# EAGLE design m1284p-40p-breakout board (EAGLE 9.6.2)
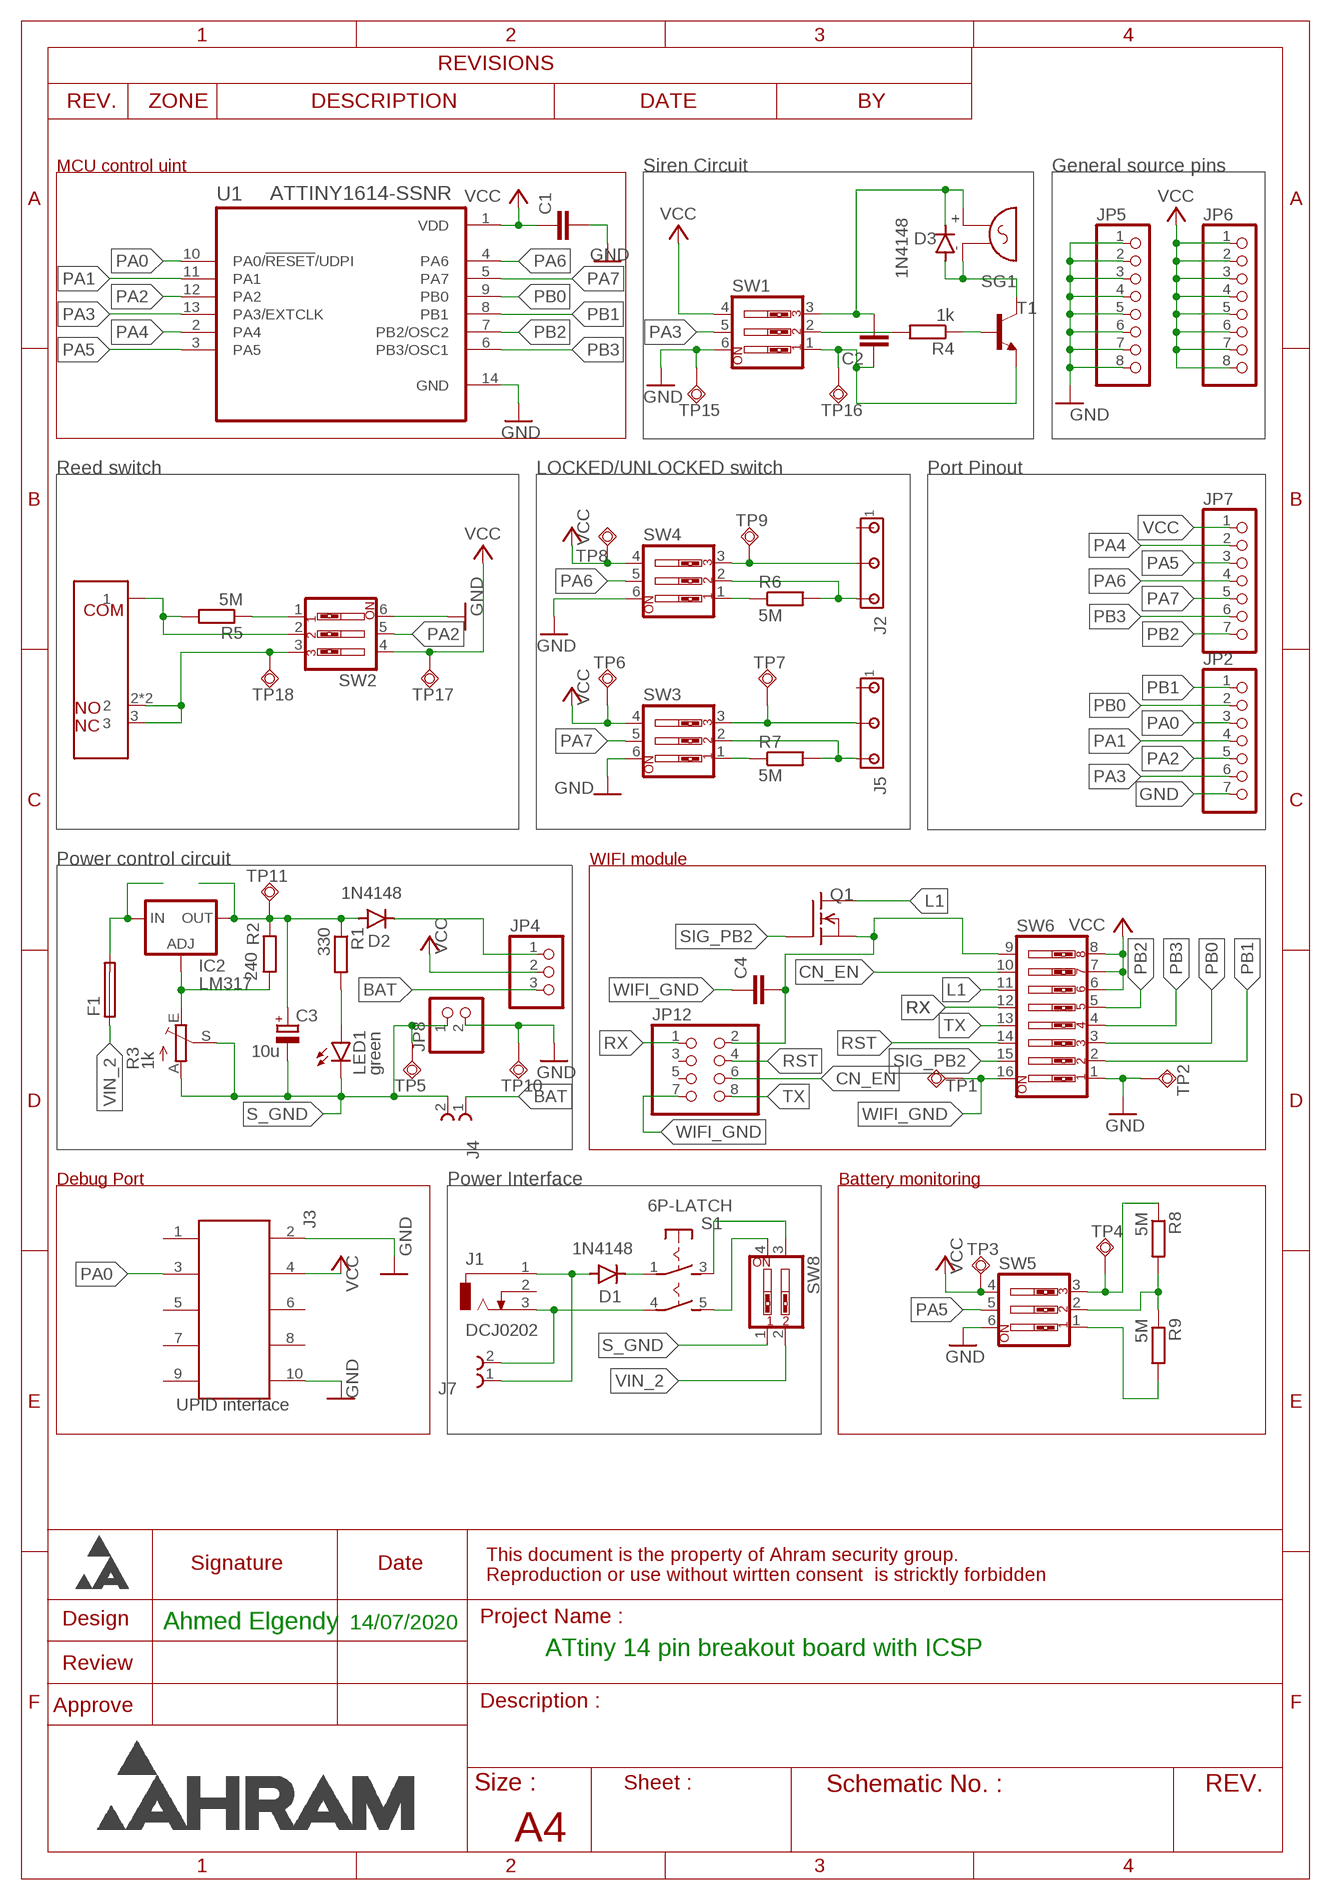
[diagram p0: schematic, sheet 1]

## Parts
C1  C-EU025-030X050  [C025-030X050]
C2  C-EU025-030X050  [C025-030X050]
C3  10u  CPOL-EUE2-4  [E2-4]
C4  C-EU025-030X050  [C025-030X050]
D1  1N4148  1N4148DO35-7  [DO35-7]
D2  1N4148  1N4148DO35-7  [DO35-7]
D3  1N4148  1N4148DO35-7  [DO35-7]
F1  SH22,5A  [SH22,5A]
IC2  LM317  LM317TS  [317TS]
J1  DCJ0202  [DCJ0202]
J2  MTA05-156_MYVSPACE1  [10X05MTA_MYV]
J3  UPID interface  612010235121  [612010235121]
J4  691101710002  [691101710002]
J5  MTA05-156_MYVSPACE1  [10X05MTA_MYV]
J7  691101710002  [691101710002]
JP2  PINHD-1X7  [1X07]
JP4  PINHD-1X3  [1X03]
JP5  PINHD-1X8  [1X08]
JP6  PINHD-1X8  [1X08]
JP7  PINHD-1X7  [1X07]
JP8  PINHD-1X2  [1X02]
JP12  PINHD-2X4  [2X04]
LED1  green  LED3MM  [LED3MM]
Q1  BSS295  [TO92]
R1  330  R-EU_0204/7  [0204/7]
R2  240  R-EU_0204/7  [0204/7]
R3  1k  TRIM_EU-RJ9W  [RJ9W]
R4  1k  R-EU_0204/7  [0204/7]
R5  5M  R-EU_0204/7  [0204/7]
R6  5M  R-EU_0204/7  [0204/7]
R7  5M  R-EU_0204/7  [0204/7]
R8  5M  R-EU_0204/7  [0204/7]
R9  5M  R-EU_0204/7  [0204/7]
S1  6P-LATCH  [TACT-6P-LATCH]
S2  REED_1513  [REED_MYV]
SG1  F/QMX  [F/QMX]
SW1  SW_DIP-3  [EDG-03]
SW2  SW_DIP-3  [EDG-03]
SW3  SW_DIP-3  [EDG-03]
SW4  SW_DIP-3  [EDG-03]
SW5  SW_DIP-3  [EDG-03]
SW6  SW_DIP-8  [EDG-08]
SW8  SW_DIP-2  [EDG-02]
T1  2N2222  [TO18]
TP1  TPSQPAD1-13  [P1-13]
TP2  TPSQPAD1-13  [P1-13]
TP3  TPSQPAD1-13  [P1-13]
TP4  TPSQPAD1-13  [P1-13]
TP5  TPSQPAD1-13  [P1-13]
TP6  TPSQPAD1-13  [P1-13]
TP7  TPSQPAD1-13  [P1-13]
TP8  TPSQPAD1-13  [P1-13]
TP9  TPSQPAD1-13  [P1-13]
TP10  TPSQPAD1-13  [P1-13]
TP11  TPSQPAD1-13  [P1-13]
TP15  TPSQPAD1-13  [P1-13]
TP16  TPSQPAD1-13  [P1-13]
TP17  TPSQPAD1-13  [P1-13]
TP18  TPSQPAD1-13  [P1-13]
U1  ATTINY1614-SSNR  [SOIC127P600X175-14N]

## Nets
BAT: J4.1 JP4.3
CN_EN: JP12.6 SW6.10
GND: C1.2 J3.2 J3.10 JP2.7 JP5.1 JP5.2 JP5.3 JP5.4 JP5.5 JP5.6 JP5.7 JP5.8 JP8.2 SW1.6 SW2.6 SW3.6 SW4.6 SW5.6 SW6.1 TP2.TP TP10.TP TP15.TP U1.14(GND)
L1: Q1.3(D) SW6.11
N$1: D1.C S1.1
N$2: C3.+ D2.A IC2.2(OUT) R1.1 R2.2 TP11.TP
N$3: D1.A J1.1 J7.1
N$4: LED1.A R1.2
N$5: R4.1 T1.2(B)
N$6: IC2.1(ADJ) R2.1 R3.E
N$7: J1.3 J7.2 S1.4
N$8: F1.2 IC2.3(IN)
N$9: J2.5 R6.2 SW4.2
N$10: R4.2 SW1.2
N$11: R5.2 S2.1 SW2.2
N$14: R8.2 R9.1 SW5.2
N$16: S1.5 SW8.4
N$18: R9.2 SW5.1
N$19: R5.1 SW2.1
N$20: J2.3 SW4.3 TP9.TP
N$21: R6.1 SW4.1
N$22: D2.C JP4.1
N$23: C2.2 D3.C SG1.+ SW1.3
N$24: C2.1 SW1.1 T1.1(E) TP16.TP
N$25: S2.2 S2.3 S2.4 SW2.3 TP18.TP
N$26: R8.1 SW5.3 TP4.TP
N$27: R7.1 SW3.1
N$28: D3.A SG1.- T1.3(C)
N$29: J5.5 R7.2 SW3.2
N$30: J5.3 SW3.3 TP7.TP
N$32: C4.2 JP12.2 Q1.1(S) SW6.9
PA0: J3.3 JP2.3 U1.10(PA0/!RESET!/UDPI)
PA1: JP2.4 U1.11(PA1)
PA2: JP2.5 SW2.5 U1.12(PA2)
PA3: JP2.6 SW1.5 U1.13(PA3/EXTCLK)
PA4: JP7.2 U1.2(PA4)
PA5: JP7.3 SW5.5 U1.3(PA5)
PA6: JP7.4 SW4.5 U1.4(PA6)
PA7: JP7.5 SW3.5 U1.5(PA7)
PB0: JP2.2 SW6.3 U1.9(PB0)
PB1: JP2.1 SW6.2 U1.8(PB1)
PB2: JP7.7 SW6.5 U1.7(PB2/OSC2)
PB3: JP7.6 SW6.4 U1.6(PB3/OSC1)
RST: JP12.4 SW6.14
RX: JP12.1 SW6.12
S_GND: C3.- J4.2 JP8.1 LED1.K(C) R3.A R3.S SW8.1 TP5.TP
SIG_PB2: Q1.2(G) SW6.15
TX: JP12.8 SW6.13
VCC: C1.1 J3.4 JP4.2 JP6.1 JP6.2 JP6.3 JP6.4 JP6.5 JP6.6 JP6.7 JP6.8 JP7.1 SW1.4 SW2.4 SW3.4 SW4.4 SW5.4 SW6.6 SW6.7 SW6.8 TP3.TP TP6.TP TP8.TP TP17.TP U1.1(VDD)
VIN_1: S1.3 SW8.3
VIN_2: F1.1 SW8.2
WIFI_GND: C4.1 JP12.7 SW6.16 TP1.TP
Unconnected: J1.2 J2.1 J3.1 J3.5 J3.6 J3.7 J3.8 J3.9 J5.1 JP12.3 JP12.5

## Notes on the sheet
- MCU control uint | Siren Circuit | General source pins
- Reed switch | LOCKED/UNLOCKED switch | Port Pinout
- Power control circuit | WIFI module
- Debug Port | Power Interface | Battery monitoring
- Ahmed Elgendy | 14/07/2020
- ATtiny 14 pin breakout board with ICSP

## Library data of the parts
C1 C2 C4 = rcl:C-EU: CAPACITOR, European symbol; SPICEPREFIX: C
C3 = rcl:CPOL-EU: POLARIZED CAPACITOR, European symbol; SPICEPREFIX: C
D1-D3 = diode:1N4148: DIODE high speed (Philips)
F1 = fuse:SH22,5A: FUSE HOLDER grid 22,5mm, isolated cap OGN0031 8201, Schurter (Buerklin); MPN: 0031.7701.11; OC_FARNELL: unknown; OC_NEWARK: 04F1224
IC2 = v-reg:LM317TS: VOLTAGE REGULATOR
J1 = con-jack:DCJ0202: DC POWER JACK Source: DCJ0202.pdf; OC_FARNELL: unknown; OC_NEWARK: unknown
J2 J5 = con-amp_edit:MTA05-156_MYV: AMP connector
J3 = Wire-to-Board (rev17c):612010235121: WR-BHD 2.54mm Male Box Header High Temperature, 10 Pins=>Code : Con_WTB_BHD_2.54_Male_THT_RS_612010235121 <http://katalog.we-online.de/media/thumbs2/eican/thb_Con_WTB_BHD_2.54_Male_THT_RS_6120xx235121_pf2.jpg> Details see: http://katalog.we-online.de/en/em/612_0xx_235_121 Created 2014-06-05, Karrer Zheng 2014 (C) Würth Elektronik
J4 J7 = Wurth_Elektronik_Electromechanic_Terminal_Blocks_Connectors_rev16b:691101710002: WR-TBL Serie 101 - 5.0mm HOrizontal Entry Modular with Pressure Clamp - 2.5mm2 Wires , 2 pins=>Code : Con-TBL_Screw_PressureClamp_691101710002 <http://katalog.we-online.de/media/images/eican/Con-TBL_Screw_PressureClamp_6911017100xx_pf2.jpg> Details see: http://katalog.we-online.de/en/em/691_101_710_0xx Created 2014-06-16, Karrer Zheng 2014 (C) Würth Elektronik
JP2 JP7 = pinhead:PINHD-1X7: PIN HEADER
JP4 = pinhead:PINHD-1X3: PIN HEADER
JP5 JP6 = pinhead:PINHD-1X8: PIN HEADER
JP8 = pinhead:PINHD-1X2: PIN HEADER
JP12 = pinhead:PINHD-2X4: PIN HEADER
LED1 = led:LED: LED OSRAM: - CHIPLED LG R971, LG N971, LY N971, LG Q971, LY Q971, LO R971, LY R971 LH N974, LH R974 LS Q976, LO Q976, LY Q976 LO Q996 - Hyper CHIPLED LW Q18S LB Q993, LB Q99A, LB R99A - SideLED LS A670, LO A670, LY A670, LG A670, LP A670 LB A673, LV A673, LT A673, LW A673 LH A674 LY A675 LS A676, LA A676, LO A676, LY A676, LW A676 LS A679, LY A679, LG A679 - Hyper Micro SIDELED® LS Y876, LA Y876, LO Y876, LY Y876 LT Y87S - SmartLED LW L88C, LW L88S LB L89C, LB L89S, LG L890 LS L89K, LO L89K, LY L89K LS L896, LA L896, LO L896, LY L896 - TOPLED LS T670, LO T670, LY T670, LG T670, LP T670 LSG T670, LSP T670, LSY T670, LOP T670, LYG T670 LG T671, LOG T671, LSG T671 LB T673, LV T673, LT T673, LW T673 LH T674 LS T676, LA T676, LO T676, LY T676, LB T676, LH T676, LSB T676, LW T676 LB T67C, LV T67C, LT T67C, LS T67K, LO T67K, LY T67K, LW E67C LS E67B, LA E67B, LO E67B, LY E67B, LB E67C, LV E67C, LT E67C LW T67C LS T679, LY T679, LG T679 LS T770, LO T770, LY T770, LG T770, LP T770 LB T773, LV T773, LT T773, LW T773 LH T774 LS E675, LA E675, LY E675, LS T675 LS T776, LA T776, LO T776, LY T776, LB T776 LHGB T686 LT T68C, LB T68C - Hyper Mini TOPLED® LB M676 - Mini TOPLED Santana® LG M470 LS M47K, LO M47K, LY M47K Source: http://www.osram.convergy.de LUXEON: - LUMILED® LXK2-PW12-R00, LXK2-PW12-S00, LXK2-PW14-U00, LXK2-PW14-V00 LXK2-PM12-R00, LXK2-PM12-S00, LXK2-PM14-U00 LXK2-PE12-Q00, LXK2-PE12-R00, LXK2-PE12-S00, LXK2-PE14-T00, LXK2-PE14-U00 LXK2-PB12-K00, LXK2-PB12-L00, LXK2-PB12-M00, LXK2-PB14-N00, LXK2-PB14-P00, LXK2-PB14-Q00 LXK2-PR12-L00, LXK2-PR12-M00, LXK2-PR14-Q00, LXK2-PR14-R00 LXK2-PD12-Q00, LXK2-PD12-R00, LXK2-PD12-S00 LXK2-PH12-R00, LXK2-PH12-S00 LXK2-PL12-P00, LXK2-PL12-Q00, LXK2-PL12-R00 Source: www.luxeon.com KINGBRIGHT: KA-3528ASYC Source: www.kingbright.com
Q1 = transistor-fet_myv:BSS295: N-Channel Enhancement MOSFET not checked
R1 R2 R4-R9 = rcl:R-EU_: RESISTOR, European symbol; SPICEPREFIX: R
R3 = pot:TRIM_EU-: POTENTIOMETER
S1 = switches-misc v2.2:6P-LATCH
S2 = reed_MYV:REED_1513
SG1 = buzzer:F/QMX: BUZZER Source: Buerklin; OC_FARNELL: unknown; OC_NEWARK: unknown
SW1-SW5 = special:SW_DIP-3: DIP SWITCH
SW6 = special:SW_DIP-8: DIP SWITCH
SW8 = special:SW_DIP-2: DIP SWITCH
T1 = transistor:2N2222: NPN TRANSISTOR
TP1-TP11 TP15-TP18 = testpad:TPSQ: Test pad
U1 = ATTINY1614-SSNR:ATTINY1614-SSNR: 20MHz, SOIC, 85C, Green, 14 SOIC .150in T/R; ARROW_ELECTRONICS-PURCHASE-URL: https://snapeda.com/shop?store=Arrow+Electronics&id=4817174; AVAILABILITY: Unavailable; DESCRIPTION: IC MCU 8BIT 16KB FLASH 14SOIC; DIGIKEY-PURCHASE-URL: https://snapeda.com/shop?store=DigiKey&id=4817174; MF: Microchip Technology; MOUSER-PURCHASE-URL: https://snapeda.com/shop?store=Mouser&id=4817174; MP: ATTINY1614-SSNR; PACKAGE: None; PRICE: None

## Board
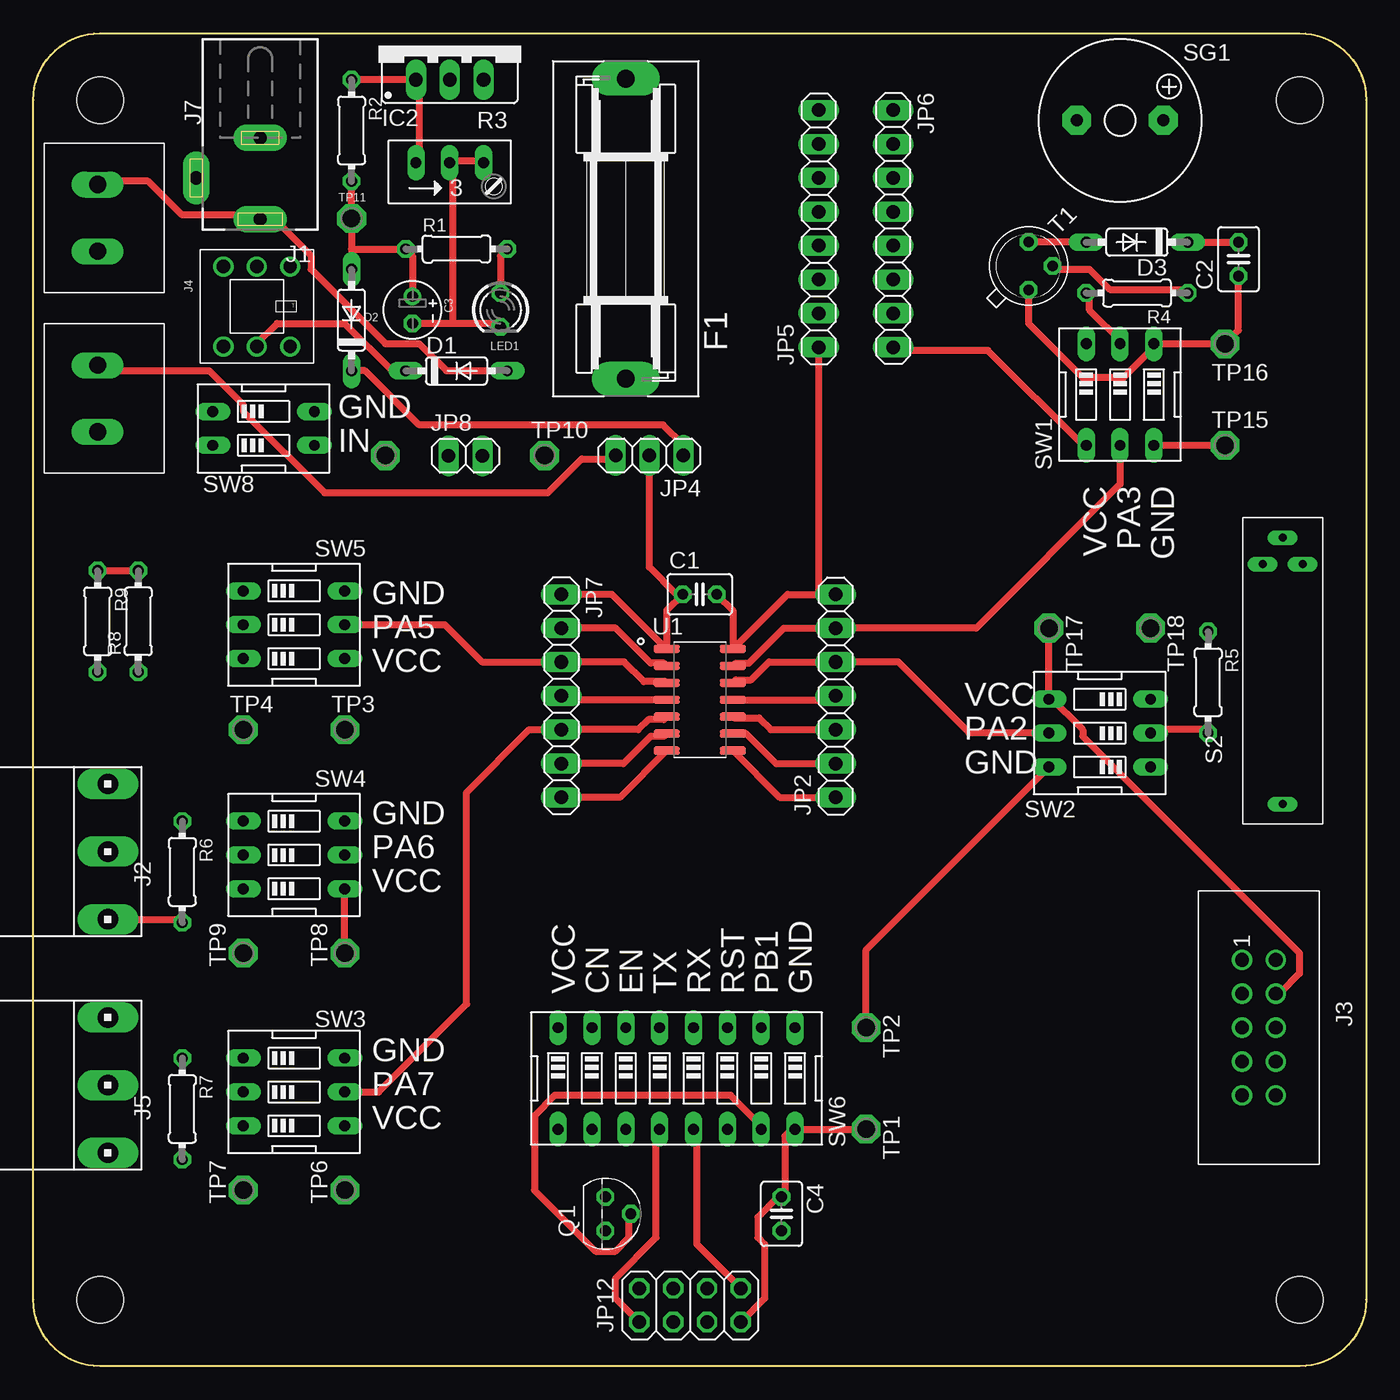
[diagram p1: board, top side]
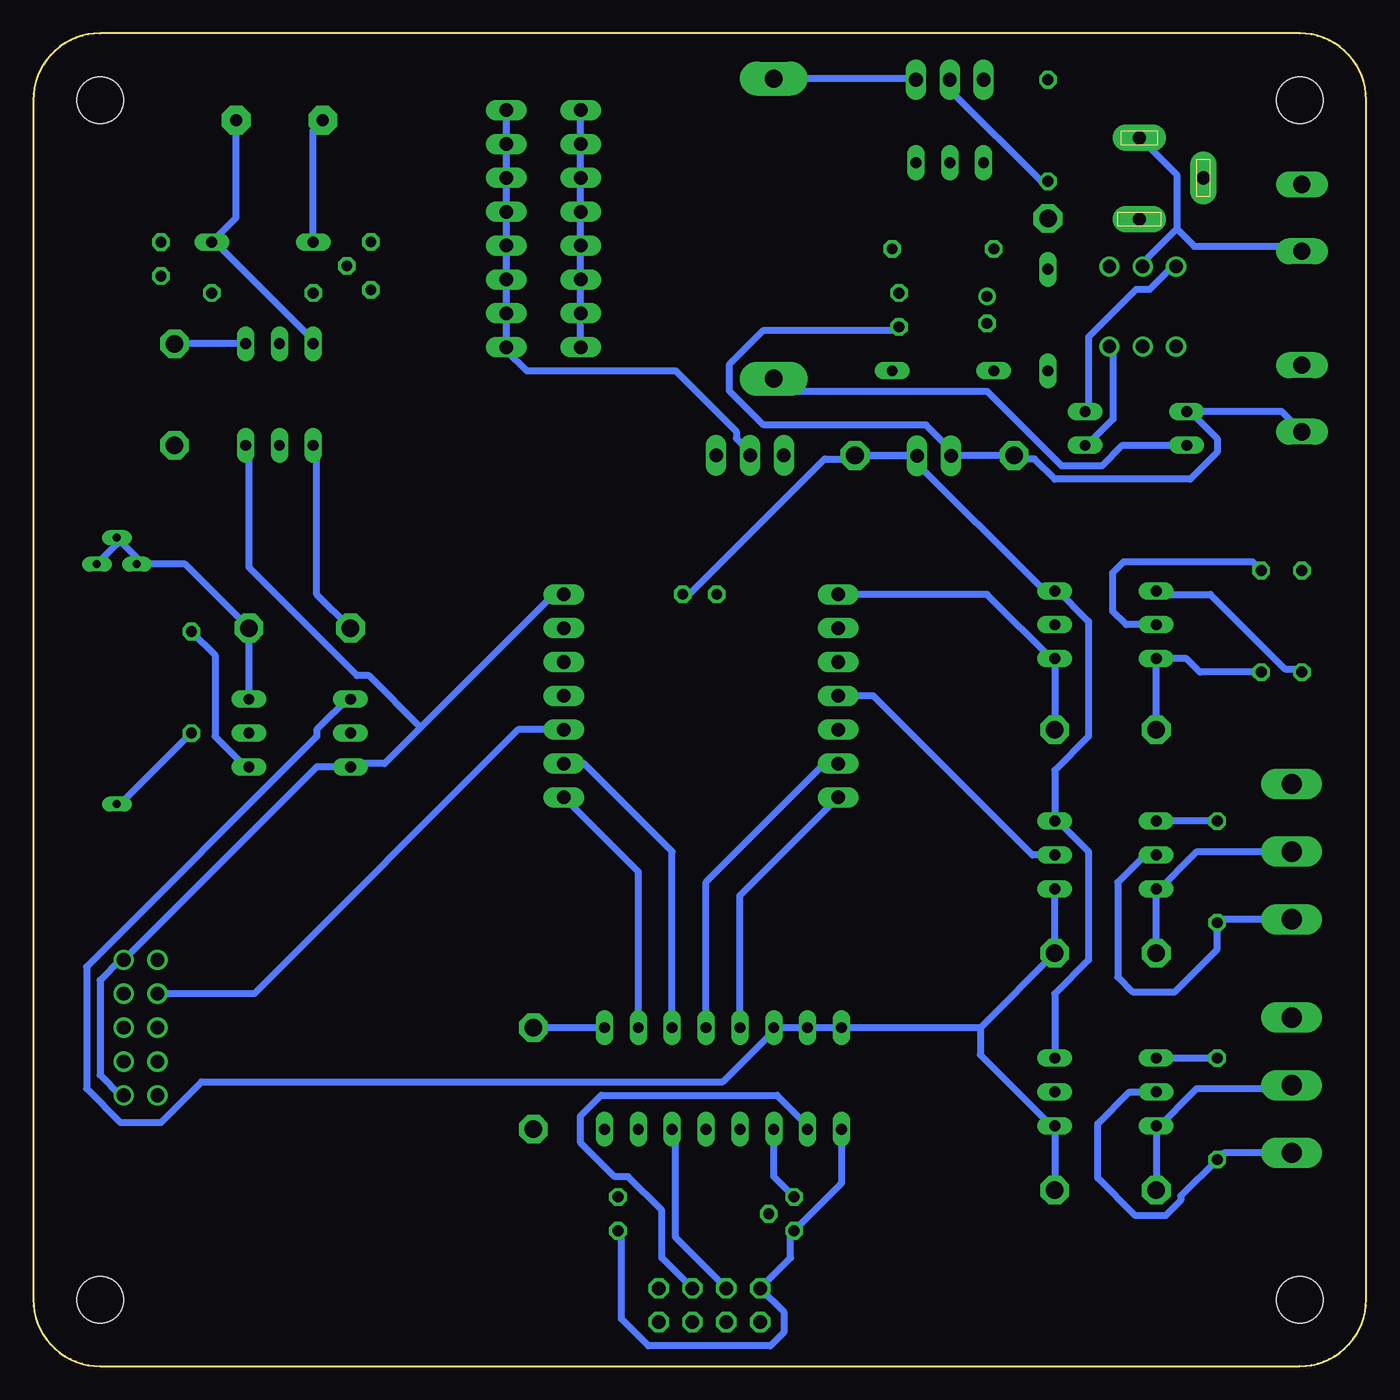
[diagram p2: board, bottom side, seen from below]

Size 100 x 100 mm. Coordinates in mm from the lower left corner, seen from the top.
Outline: 0,5 0,95 arc-90 5,100 95,100 arc-90 100,95 100,5 arc-90 95,0 5,0 arc-90 0,5
Copper layers (1*16): Top 0.035mm / dielectric 1.5mm / Bottom 0.035mm
Design rules "default *": minimum track width 20mil, minimum drill 0.35mm, track to track 20mil, track to pad 20mil, pad to pad 20mil, via to via 20mil, smd to smd 20mil, copper to edge 40mil, drill to drill 6mil, minimum pad ring 10mil, minimum via ring 8mil, stop-mask expansion 4mil, vias tented up to drill 0mil, thermal gap 10mil
Holes 3.5 mm at 5,95 95,95 95,5 5,5

### Footprints (pad centres in the part's own frame; a part is rotated, then mirrored left to right if it is on the bottom)
C025-030X050 = drill 0.813 octagon: 1 -1.27,0; 2 1.27,0
E2-4 = drill 0.813 pad 1.27: + -1.016,0 | drill 0.813 pad 1.27 octagon: - 1.016,0
DO35-7 = drill 0.813 long: A 3.81,0; C -3.81,0
SH22,5A = drill 1.321 pad 2.54 long: 1 -11.252,0; 2 11.252,0
317TS = drill 1.016 long: 1 -2.54,-2.54; 2 0,-2.54; 3 2.54,-2.54
DCJ0202 = drill 1 pad 2 long: 1 0,3.1; 2 4.8,0; 3 0,-3
10X05MTA_MYV = drill 1.524 long: 1 5.08,0; 3 0,0; 5 -5.08,0
612010235121 = drill 1.02: 1 -5.08,-1.27; 2 -5.08,1.27; 3 -2.54,-1.27; 4 -2.54,1.27; 5 0,-1.27; 6 0,1.27; 7 2.54,-1.27; 8 2.54,1.27; 9 5.08,-1.27; 10 5.08,1.27
691101710002 = drill 1.3 long: 1 -5,0; 2 0,0
1X07 = drill 1.016 long: 1 -7.62,0; 2 -5.08,0; 3 -2.54,0; 4 0,0; 5 2.54,0; 6 5.08,0; 7 7.62,0
1X03 = drill 1.016 long: 1 -2.54,0; 2 0,0; 3 2.54,0
1X08 = drill 1.016 long: 1 -8.89,0; 2 -6.35,0; 3 -3.81,0; 4 -1.27,0; 5 1.27,0; 6 3.81,0; 7 6.35,0; 8 8.89,0
1X02 = drill 1.016 long: 1 -1.27,0; 2 1.27,0
2X04 = drill 1.016 octagon: 1 -3.81,-1.27; 2 -3.81,1.27; 3 -1.27,-1.27; 4 -1.27,1.27; 5 1.27,-1.27; 6 1.27,1.27; 7 3.81,-1.27; 8 3.81,1.27
LED3MM = drill 0.813 octagon: A -1.27,0; K 1.27,0
TO92 = drill 0.813 octagon: 1 1.27,0; 2 0,1.905; 3 -1.27,0
0204/7 = drill 0.813 octagon: 1 -3.81,0; 2 3.81,0
RJ9W = drill 0.813 long: A 2.54,0.635; E -2.54,0.635; S 0,0.635
TACT-6P-LATCH = drill 1: 1 0,-3; 2 -2.5,-3; 3 2.5,-3; 4 0,3; 5 -2.5,3; 6 2.5,3
REED_MYV = drill 0.6 long: 1 0,0; 2 0,20; 3 -1.5,18; 4 1.5,18
F/QMX = drill 0.914 pad 2.159 octagon: + 3.251,0; - -3.251,0
EDG-03 = drill 0.813 long: 1 -2.54,-3.81; 2 0,-3.81; 3 2.54,-3.81; 4 2.54,3.81; 5 0,3.81; 6 -2.54,3.81
EDG-08 = drill 0.813 long: 1 -8.89,-3.81; 2 -6.35,-3.81; 3 -3.81,-3.81; 4 -1.27,-3.81; 5 1.27,-3.81; 6 3.81,-3.81; 7 6.35,-3.81; 8 8.89,-3.81; 9 8.89,3.81; 10 6.35,3.81; 11 3.81,3.81; 12 1.27,3.81; 13 -1.27,3.81; 14 -3.81,3.81; 15 -6.35,3.81; 16 -8.89,3.81
EDG-02 = drill 0.813 long: 1 -1.27,-3.81; 2 1.27,-3.81; 3 1.27,3.81; 4 -1.27,3.81
TO18 = drill 0.813 octagon: 1 -1.27,-1.27; 2 1.27,-1.27; 3 1.27,1.27
P1-13 = drill 1.321 pad 2.159 octagon: TP 0,0
SOIC127P600X175-14N = smd 1.95 x 0.59: 1 -2.48,3.81; 2 -2.48,2.54; 3 -2.48,1.27; 4 -2.48,0; 5 -2.48,-1.27; 6 -2.48,-2.54; 7 -2.48,-3.81; 8 2.48,-3.81; 9 2.48,-2.54; 10 2.48,-1.27; 11 2.48,0; 12 2.48,1.27; 13 2.48,2.54; 14 2.48,3.81

### Placement (x,y rotation side)
C1  50,57.91 0 top
C2  90.42,83.06 90 top
C3  28.45,79.25 270 top
C4  56.13,11.43 270 top
D1  31.75,74.68 0 top
D2  23.88,78.49 90 top
D3  82.8,84.33 180 top
F1  44.45,85.34 90 top
IC2  31.24,99.06 0 top
J1  17.02,89.15 180 top
J2  5.59,38.61 90 top
J3  91.95,25.4 270 top
J4  4.83,70.1 270 top
J5  5.59,21.08 90 top
J7  4.83,83.65 270 top
JP2  60.2,50.29 90 top
JP4  46.23,68.33 180 top
JP5  58.93,85.34 90 top
JP6  64.52,85.34 270 top
JP7  39.62,50.29 270 top
JP8  32.42,68.31 0 top
JP12  49.28,4.57 0 top
LED1  35.05,79.25 270 top
Q1  42.93,11.43 270 top
R1  31.75,83.82 0 top
R2  23.88,92.71 270 top
R3  31.24,89.66 0 top
R4  82.8,80.52 180 top
R5  88.14,51.31 270 top
R6  11.18,37.08 270 top
R7  11.18,19.3 270 top
R8  7.87,55.88 90 top
R9  4.83,55.88 270 top
S1  16.76,79.5 0 top
S2  93.73,42.16 0 top
SG1  81.53,93.47 0 top
SW1  81.53,72.9 180 top
SW2  80.01,47.5 90 top
SW3  19.56,20.57 270 top
SW4  19.56,38.35 270 top
SW5  19.56,55.63 270 top
SW6  48.26,21.59 180 top
SW8  17.27,70.36 270 top
T1  74.68,82.55 45 top
TP1  62.48,17.78 270 top
TP2  62.48,25.4 270 top
TP3  23.37,47.75 0 top
TP4  15.75,47.75 0 top
TP5  26.42,68.33 0 top
TP6  23.37,13.21 90 top
TP7  15.75,13.21 0 top
TP8  23.37,30.99 90 top
TP9  15.75,30.99 90 top
TP10  38.35,68.33 0 top
TP11  23.88,86.11 0 top
TP15  89.41,69.09 0 top
TP16  89.41,76.71 0 top
TP17  76.2,55.37 270 top
TP18  83.82,55.37 270 top
U1  50,50 0 top

### Tracks (layer width: path | path; a pad name or v marks a point on that pad's centre or on a via)
BAT
  Top 0.508: JP4.3 43.69,68.07 41.15,68.07 38.61,65.53 21.84,65.53 15.75,71.63 15.75,72.14 13.21,74.68 5.08,74.68 J4.1
CN_EN
  Bottom 0.508: JP12.6 52.83,8.13 52.83,11.68 55.37,14.22 56.39,14.22 58.93,16.76 58.93,18.8 57.4,20.32 44.2,20.32 42.16,18.29 42.16,17.78 SW6.10
GND
  Top 0.508: 58.93,57.91 56.58,57.91 U1.14 52.48,56.7 C1.2 | 58.93,57.91 JP5.1 | 58.93,57.91 JP2.7 | TP2.TP 62.48,31.24 SW2.6 | SW1.6 TP15.TP
  Bottom 0.508: SW6.1 TP2.TP | SW3.6 23.37,27.94 20.83,30.48 20.83,38.61 23.37,41.15 | 23.37,58.42 24.38,58.42 34.04,68.07 JP8.2 | 23.37,41.15 23.37,44.7 20.83,47.24 20.83,55.88 23.37,58.42 | 23.37,41.15 SW4.6 | 23.37,58.42 SW5.6 | J3.10 93.47,20.32 95,21.84 95,28.96 93.47,30.48 J3.2 78.74,44.96 SW2.6 76.2,45.21 73.66,45.21 70.94,47.93 | 70.94,47.93 60.96,57.91 JP2.7 | 70.94,47.93 74.82,51.82 75.71,51.82 83.82,59.92 83.82,69.09 SW1.6 | 38.37,68.31 TP10.TP 38.34,68.31 JP8.2 | C1.2 50.8,57.91 40.64,68.07 38.61,68.07 38.37,68.31 | JP5.1 JP5.2 | JP5.2 | JP5.2 58.93,81.5 | 58.93,81.5 JP5.3 | JP5.3 58.93,84 | 58.93,84 JP5.4 | JP5.4 58.93,86.5 | 58.93,86.5 JP5.5 | JP5.5 JP5.6 | JP5.6 58.93,89.5 | 58.93,89.5 JP5.7 | JP5.7 58.93,92 | 58.93,92 JP5.8 | JP5.2 59,79 JP5.2 | 58.93,86.5 59,86.5 JP5.5 | JP5.3 59,81.5 58.93,81.5 | JP5.4 59,84 58.93,84 | JP5.6 59,89.5 58.93,89.5 | JP5.7 59,92 58.93,92 | JP8.2 38.37,68.31
L1
  Bottom 0.508: Q1.3 44.45,14.22 SW6.11
N$1
  Top 0.508: D1.C 26.92,74.68 23.37,78.23 18.29,78.23 16.76,76.71 S1.1
N$2
  Top 0.508: 23.88,83.82 TP11.TP R2.2 | 23.88,83.82 D2.A | 23.88,83.82 R1.1 28.45,83.31 C3.+
  Bottom 0.508: R2.2 24.38,88.9 30.99,95.5 30.99,96.52 IC2.2
N$3
  Top 0.508: D1.A 30.99,74.68 28.96,76.71 26.42,76.71 20.83,82.3 20.83,83.31 18.29,85.85 17.27,85.85 J1.1 16.76,86.36 11.18,86.36 8.64,88.9 4.97,88.9 J7.1
N$4
  Top 0.508: LED1.A 35.05,83.31 R1.2
N$5
  Top 0.508: R4.1 86.36,80.77 80.77,80.77 79.25,82.3 76.71,82.3 T1.2
N$6
  Top 0.508: R2.1 IC2.1 28.96,96.52 28.96,90.42 R3.E
N$7
  Bottom 0.508: 14.22,85.34 16.76,82.8 S1.4 | 14.22,85.34 14.22,89.41 16.76,91.95 J1.3 | J7.2 5.19,84.02 12.9,84.02 14.22,85.34
N$8
  Bottom 0.508: IC2.3 33.86,96.6 F1.2
N$9
  Top 0.508: J2.5 11.18,33.53 R6.2
  Bottom 0.508: SW4.2 16.59,38.35 18.63,36.31 18.63,29.19 17.54,28.1 14.35,28.1 11.18,31.27 R6.2 10.92,33.53 J2.5
N$10
  Top 0.508: R4.2 79.25,80.26 79.25,79.25 81.79,76.71 SW1.2
N$11
  Top 0.508: SW2.2 83.82,47.75 87.88,47.75 R5.2
  Bottom 0.508: R5.2 93.47,42.16 S2.1
N$14
  Top 0.508: R9.1 R8.2
  Bottom 0.508: SW5.2 18,55.63 19.03,56.65 19.03,59.52 18.22,60.33 8.52,60.33 R8.2
N$16
  Bottom 0.508: SW8.4 20.83,71.63 20.83,77.22 17.27,80.77 16.26,80.77 14.73,82.3 S1.5
N$18
  Bottom 0.508: R9.2 5.08,52.32 6.1,52.32 11.68,57.91 15.75,57.91 SW5.1
N$19
  Bottom 0.508: R5.1 86.36,53.34 86.36,47.24 84.33,45.21 83.82,45.21 SW2.1
N$20
  Bottom 0.508: J2.3 12.7,38.61 15.75,35.56 SW4.3 TP9.TP
N$21
  Bottom 0.508: R6.1 SW4.1
N$22
  Top 0.508: D2.C 24.89,74.68 28.96,70.61 47.24,70.61 48.77,69.09 JP4.1
N$23
  Top 0.508: D3.C C2.2
  Bottom 0.508: SW1.3 79.25,76.71 79.25,77.22 86.36,84.33 D3.C 84.78,86.16 SG1.+
N$24
  Top 0.508: 84.31,76.69 89.39,76.69 TP16.TP 90.42,77.72 C2.1 | T1.1 74.68,78.23 78.74,74.17 81.79,74.17 84.31,76.69 | 84.31,76.69 84.33,76.71 SW1.1
  Bottom 0.508: SW1.1 TP16.TP
N$25
  Bottom 0.508: S2.4 93.73,61.66 S2.2 92.23,60.66 S2.3 88.61,60.16 TP18.TP SW2.3
N$26
  Bottom 0.508: R8.1 12.47,52.07 13.49,53.09 SW5.3 TP4.TP
N$27
  Bottom 0.508: SW3.1 R7.1
N$28
  Top 0.508: D3.A 74.68,84.33 T1.3
  Bottom 0.508: D3.A 78.99,92.76 SG1.-
N$29
  Bottom 0.508: J5.5 10.67,16 R7.2 13.91,12.76 13.91,12.45 15.07,11.29 17.31,11.29 20.14,14.11 20.14,18.19 17.76,20.57 SW3.2
N$30
  Bottom 0.508: J5.3 5.59,20.83 12.7,20.83 15.75,17.78 SW3.3 TP7.TP
N$32
  Bottom 0.508: C4.2 55.88,10.16 55.88,3.56 53.85,1.52 44.7,1.52 43.69,2.54 43.69,4.06 JP12.2 43.18,8.13 43.18,9.91 Q1.1 39.37,13.72 SW6.9
PA0
  Top 0.508: U1.10 52.57,48.64 54.45,48.64 55.34,47.75 JP2.3
  Bottom 0.508: JP2.3 63.62,47.75 83.43,27.94 J3.3
PA1
  Top 0.508: U1.11 59.91,50 JP2.4
PA2
  Top 0.508: U1.12 52.69,51.48 53.85,51.48 55.2,52.83 JP2.5 64.9,52.83 70.23,47.5 SW2.5
PA3
  Top 0.508: U1.13 52.69,52.75 53.68,52.75 56.3,55.37 JP2.6 70.74,55.37 81.53,66.17 SW1.5
PA4
  Top 0.508: U1.2 47.31,52.75 46.32,52.75 43.7,55.37 JP7.2
PA5
  Top 0.508: U1.3 47.43,51.36 45.81,51.36 44.33,52.83 JP7.3 33.66,52.83 30.86,55.63 SW5.5
PA6
  Top 0.508: U1.4 39.92,50 JP7.4
  Bottom 0.508: SW4.5 25.04,38.35 36.98,50.29 JP7.4
PA7
  Top 0.508: U1.5 47.31,48.52 46.15,48.52 45.38,47.75 JP7.5 37.21,47.75 32.51,43.05 32.51,27.18 25.91,20.57 SW3.5
PB0
  Top 0.508: U1.9 52.52,47.5 53.43,47.5 55.72,45.21 JP2.2
  Bottom 0.508: SW6.3 52.07,38.61 58.67,45.21 JP2.2
PB1
  Top 0.508: U1.8 56,42.67 JP2.1
  Bottom 0.508: SW6.2 54.61,37.08 JP2.1
PB2
  Top 0.508: U1.7 44,42.67 JP7.7
  Bottom 0.508: SW6.5 46.99,35.31 JP7.7
PB3
  Top 0.508: U1.6 47.31,47.25 46.32,47.25 44.28,45.21 JP7.6
  Bottom 0.508: SW6.4 49.53,36.32 40.64,45.21 JP7.6
RST
  Bottom 0.508: JP12.4 51.82,9.65 51.82,17.78 SW6.14
RX
  Top 0.508: JP12.1 43.69,5.08 43.69,6.6 46.74,9.65 46.74,17.78 SW6.12
S_GND
  Top 0.508: R3.A 33.53,90.42 31.5,90.42 R3.S 31.5,89.92 31.5,78.23 | 31.5,78.23 35.05,78.23 LED1.K | 31.5,78.23 C3.-
  Bottom 0.508: LED1.K 35.05,77.72 45.21,77.72 47.75,75.18 47.75,73.15 45.21,70.61 33.02,70.61 30.99,68.58 JP8.1 31.14,68.33 TP5.TP 26.42,68.07 24.89,68.07 23.37,66.55 13.21,66.55 11.18,68.58 11.18,69.6 13.21,71.63 SW8.1 6.35,71.63 J4.2
SIG_PB2
  Top 0.508: Q1.2 44.7,11.18 44.7,9.65 43.69,8.64 42.16,8.64 37.59,13.21 37.59,18.8 39.12,20.32 52.32,20.32 54.86,17.78 SW6.15
TX
  Top 0.508: JP12.8 49.78,9.14 49.78,17.78 SW6.13
VCC
  Top 0.508: JP7.1 43.42,57.91 U1.1 47.52,56.7 C1.1 48.26,57.91 46.23,59.94 JP4.2 | 76.2,50.29 TP17.TP | TP8.TP SW4.4 | 76.2,50.29 78.74,47.75 78.74,47.24 95,30.99 95,29.46 93.47,27.94 J3.4 | 76.2,50.29 SW2.4 | JP6.8 64.52,76.2 71.63,76.2 78.74,69.09 SW1.4
  Bottom 0.508: 28.96,25.4 SW6.8 SW6.7 SW6.6 44.7,25.4 44.7,24.89 48.26,21.34 87.38,21.34 90.42,18.29 93.47,18.29 96.01,20.83 96.01,29.97 78.74,47.24 78.74,47.75 76.2,50.29 SW2.4 | 28.96,25.4 TP8.TP SW4.4 | 28.96,25.4 28.96,23.37 23.88,18.29 23.37,18.29 SW3.4 TP6.TP | JP7.1 28.45,57.91 23.37,52.83 SW5.4 TP3.TP | TP17.TP 78.74,57.91 78.74,69.09 SW1.4 | JP4.2 46.23,68.58 47.24,69.6 47.24,70.1 51.82,74.68 62.99,74.68 64.52,76.2 JP6.8 JP6.7 | JP6.1 64.52,92 | 64.52,92 JP6.2 | JP6.2 64.52,89.5 | 64.52,89.5 JP6.3 | JP6.3 JP6.4 | JP6.4 64.52,86.5 | 64.52,86.5 JP6.5 | JP6.5 64.52,84 | 64.52,84 JP6.6 | JP6.6 64.52,81.5 | 64.52,81.5 JP6.7 | JP6.7 | JP6.7 64.5,79 JP6.7 | 64.52,86.5 64.5,86.5 JP6.4 | JP6.6 64.5,81.5 64.52,81.5 | JP6.5 64.5,84 64.52,84 | JP6.3 64.5,89.5 64.52,89.5 | JP6.2 64.5,92 64.52,92
VIN_1
  Bottom 0.508: SW8.3 20.95,69.09 19,71.04 19,76.24 S1.3
VIN_2
  Bottom 0.508: SW8.2 18.29,69.09 19.81,67.56 22.86,67.56 28.45,73.15 43.69,73.15 44.2,73.66 F1.1
WIFI_GND
  Top 0.508: JP12.7 54.86,5.08 54.86,9.14 54.36,9.65 54.36,11.18 55.88,12.7 C4.1 56.39,12.7 56.39,17.27 56.9,17.78 SW6.16 TP1.TP

### Text on the board
tNames: GND | IN | VCC | PA3 | GND | GND | PA5 | VCC | VCC | PA2 | GND | GND | PA6 | VCC | VCC | CN | EN | TX | RX | RST | PB1 | GND | GND | PA7 | VCC